# EAGLE design 20190404pcb (EAGLE 9.1.1)
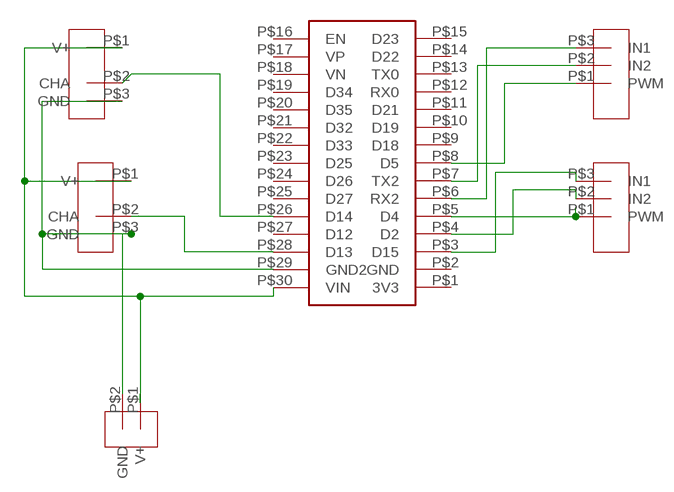
[diagram p0: schematic, sheet 1]

## Parts
LE  ENCODER  [ENCODER]
LM  MOTORDRIVER  [MOTORDRIVER]
RE  ENCODER  [ENCODER]
RM  MOTORDRIVER  [MOTORDRIVER]
U$1  ESP32  [ESP32]
U$9  SOURCE  [SOURCE]

## Nets
N$2: RE.P$2(CHA) U$1.P$26(D14)
N$4: LE.P$3(GND) RE.P$3(GND) U$1.P$29(GND2) U$9.P$2(GND)
N$5: LE.P$2(CHA) U$1.P$28(D13)
N$6: LE.P$1(V+) RE.P$1(V+) U$1.P$30(VIN) U$9.P$1(V+)
N$9: LM.P$3(IN1) U$1.P$3(D15)
N$10: LM.P$2(IN2) U$1.P$4(D2)
N$11: LM.P$1(PWM) U$1.P$5(D4)
N$12: RM.P$3(IN1) U$1.P$6(RX2)
N$13: RM.P$2(IN2) U$1.P$7(TX2)
N$14: RM.P$1(PWM) U$1.P$8(D5)
Unconnected: U$1.P$1(3V3) U$1.P$2(GND) U$1.P$9(D18) U$1.P$10(D19) U$1.P$11(D21) U$1.P$12(RX0) U$1.P$13(TX0) U$1.P$14(D22) U$1.P$15(D23) U$1.P$16(EN) U$1.P$17(VP) U$1.P$18(VN) U$1.P$19(D34) U$1.P$20(D35) U$1.P$21(D32) U$1.P$22(D33) U$1.P$23(D25) U$1.P$24(D26) U$1.P$25(D27) U$1.P$27(D12)

## Library data of the parts
LE RE = ROBOT_LIBRARY:ENCODER
LM RM = ROBOT_LIBRARY:MOTORDRIVER
U$1 = ROBOT_LIBRARY:ESP32
U$9 = ROBOT_LIBRARY:SOURCE

## Board
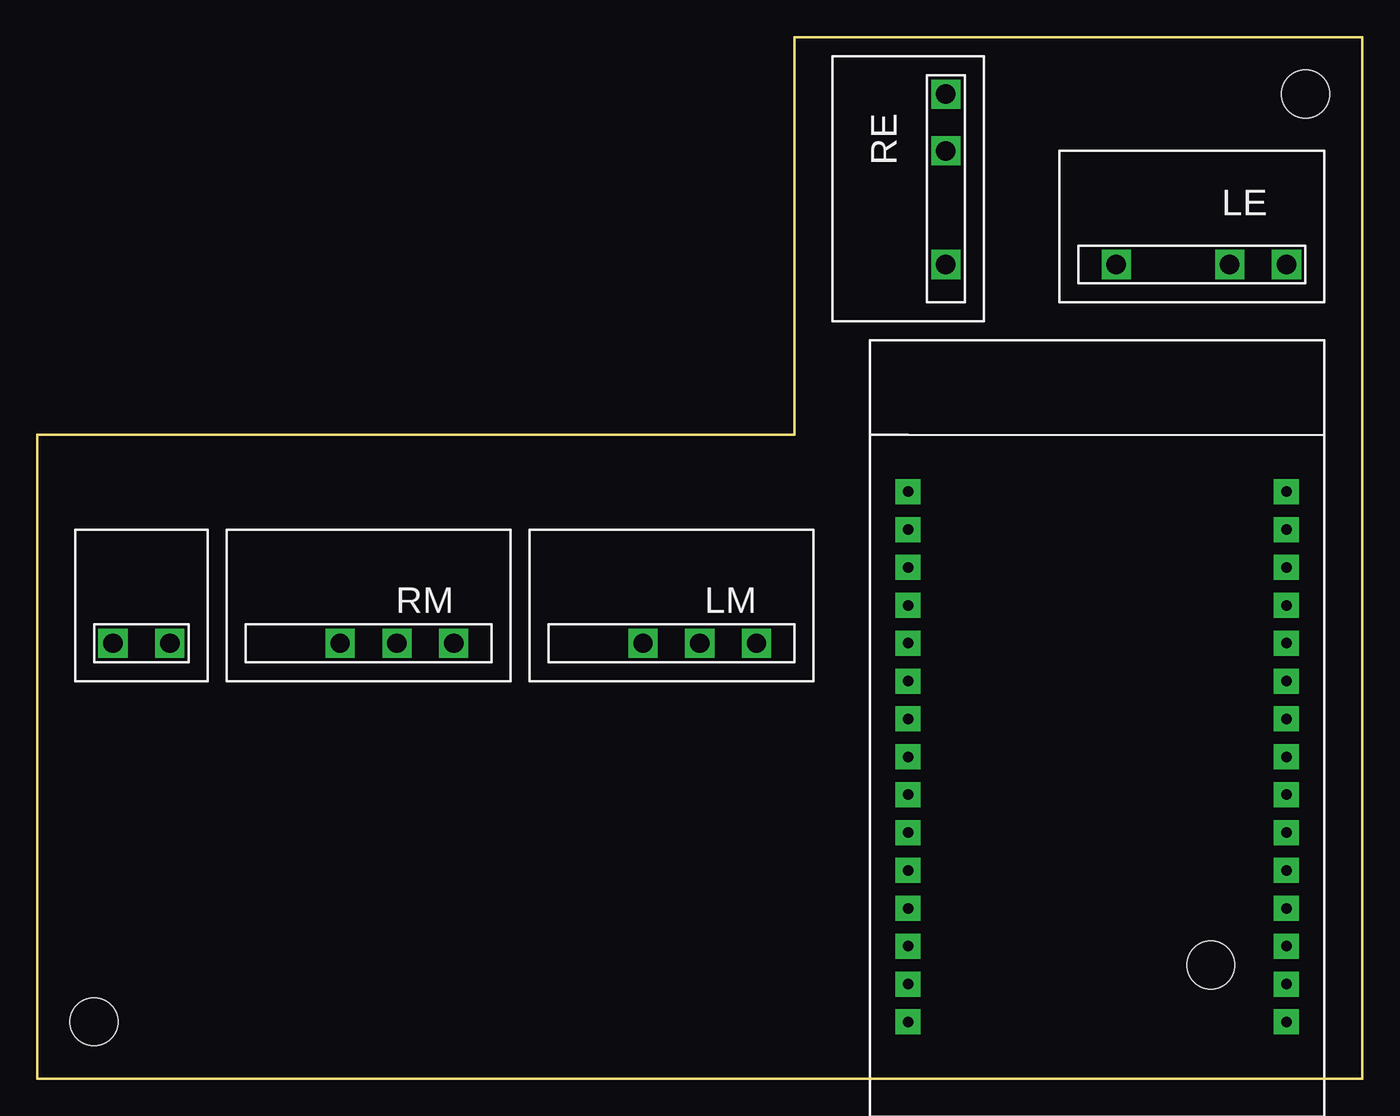
[diagram p1: board, top side]
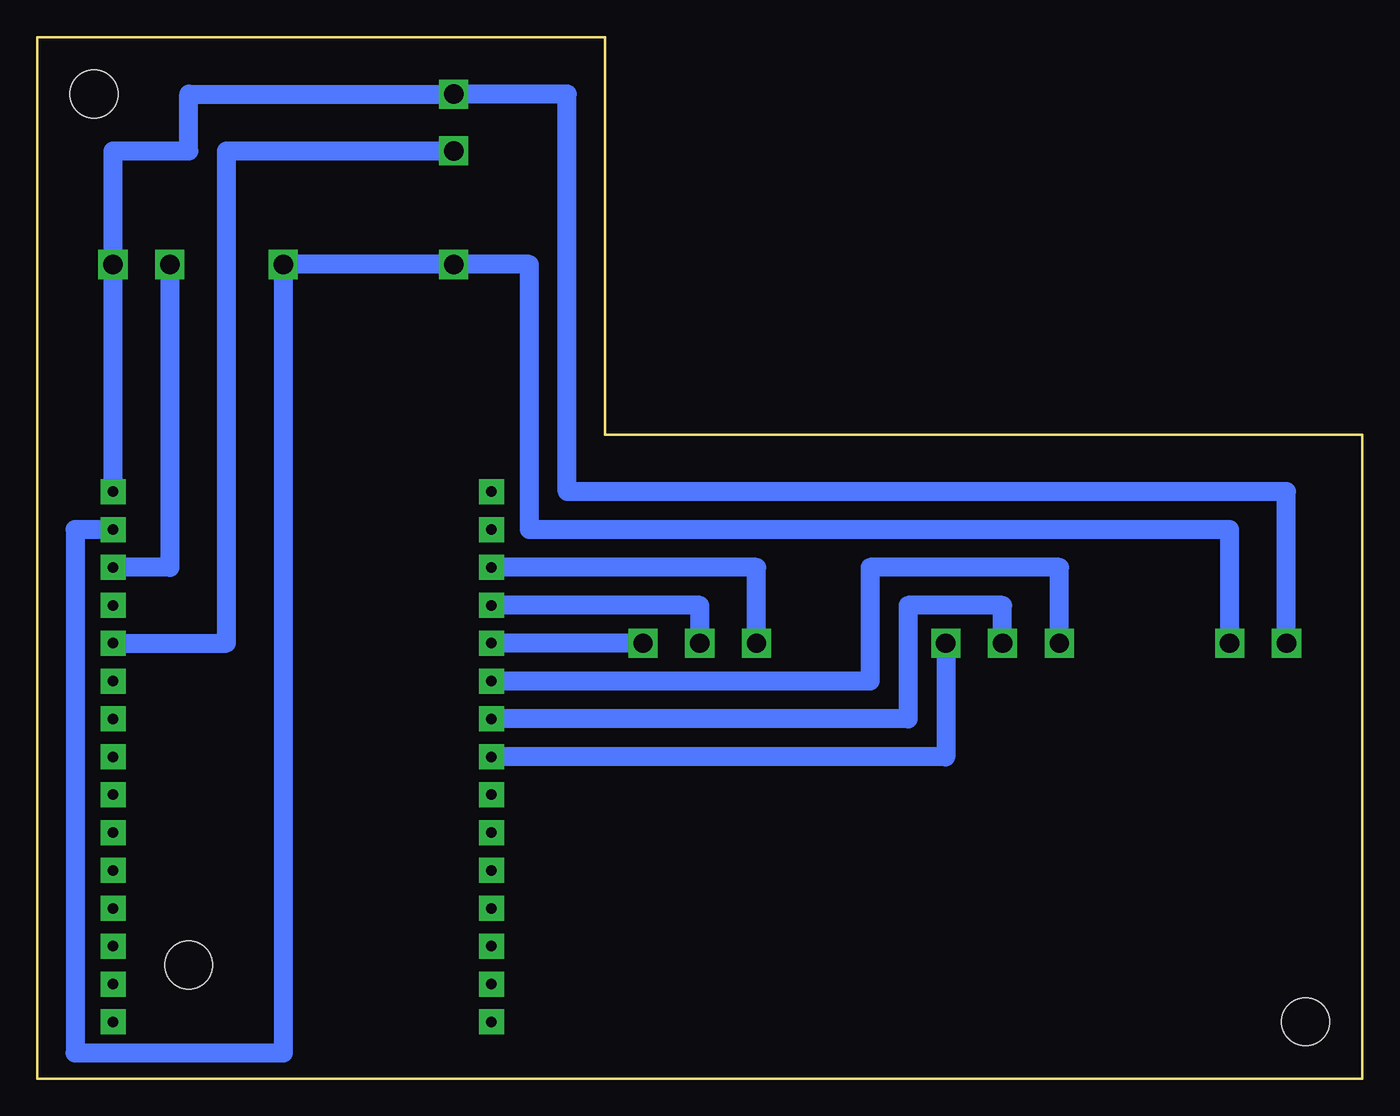
[diagram p2: board, bottom side, seen from below]

Size 88.9 x 69.85 mm. Coordinates in mm from the lower left corner, seen from the top.
Outline: 0,0 0,43.18 50.8,43.18 50.8,69.85 88.9,69.85 88.9,0 0,0
Copper layers (1*16): Top 0.035mm / dielectric 1.5mm / Bottom 0.035mm
Design rules "default *": minimum track width 50mil, minimum drill 0.35mm, track to track 12mil, track to pad 6mil, pad to pad 6mil, via to via 6mil, smd to smd 6mil, copper to edge 40mil, drill to drill 6mil, minimum pad ring 10mil, minimum via ring 8mil, stop-mask expansion 4mil, vias tented up to drill 0mil, thermal gap 10mil
Holes 3.2 mm at 85.09,66.04 3.81,3.81 78.74,7.62

### Footprints (pad centres in the part's own frame; a part is rotated, then mirrored left to right if it is on the bottom)
ENCODER = drill 1.3 pad 1.676 square: P$1 0,0; P$2 0,3.81 | drill 1.3 pad 1.778 square: P$3 0,11.43
MOTORDRIVER = drill 1.3 pad 1.676 square: P$1 0,0; P$2 0,3.81 | drill 1.3 pad 1.778 square: P$3 0,7.62
ESP32 = drill 0.7 pad 1.676 square: P$1 2.54,0; P$2 2.54,2.54; P$3 2.54,5.08; P$4 2.54,7.62; P$5 2.54,10.16; P$6 2.54,12.7; P$7 2.54,15.24; P$8 2.54,17.78; P$9 2.54,20.32; P$10 2.54,22.86; P$11 2.54,25.4; P$12 2.54,27.94; P$13 2.54,30.48; P$14 2.54,33.02; P$15 2.54,35.56; P$16 -22.86,35.56; P$17 -22.86,33.02; P$18 -22.86,30.48; P$19 -22.86,27.94; P$20 -22.86,25.4; P$21 -22.86,22.86; P$22 -22.86,20.32; P$23 -22.86,17.78; P$24 -22.86,15.24; P$25 -22.86,12.7; P$26 -22.86,10.16; P$27 -22.86,7.62; P$28 -22.86,5.08; P$29 -22.86,2.54; P$30 -22.86,0
SOURCE = drill 1.3 pad 1.778 square: P$1 0,0; P$2 0,3.81

### Placement (x,y rotation side)
LE  83.82,54.61 90 top
LM  48.26,29.21 90 top
RE  60.96,66.04 180 top
RM  27.94,29.21 90 top
U$1  60.96,39.37 180 top
U$9  5.08,29.21 270 top

### Tracks (layer width: path | path; a pad name or v marks a point on that pad's centre or on a via)
N$2
  Bottom 1.27: U$1.P$26 76.2,29.21 76.2,62.23 RE.P$2
N$4
  Bottom 1.27: U$9.P$2 8.89,36.83 55.88,36.83 55.88,54.61 RE.P$3 LE.P$3 72.39,1.73 86.36,1.73 86.36,36.83 U$1.P$29
N$5
  Bottom 1.27: LE.P$2 80.01,34.29 U$1.P$28
N$6
  Bottom 1.27: U$9.P$1 5.08,39.37 53.34,39.37 53.34,66.04 RE.P$1 78.74,66.04 78.74,62.23 83.82,62.23 LE.P$1 U$1.P$30
N$9
  Bottom 1.27: LM.P$3 40.64,34.29 U$1.P$3
N$10
  Bottom 1.27: LM.P$2 44.45,31.75 U$1.P$4
N$11
  Bottom 1.27: LM.P$1 U$1.P$5
N$12
  Bottom 1.27: RM.P$3 20.32,34.29 33.02,34.29 33.02,26.67 U$1.P$6
N$13
  Bottom 1.27: RM.P$2 24.13,31.75 30.48,31.75 30.48,24.13 U$1.P$7
N$14
  Bottom 1.27: RM.P$1 27.94,21.59 U$1.P$8